# Altium schematic sheet W5500.SchDoc
size A4
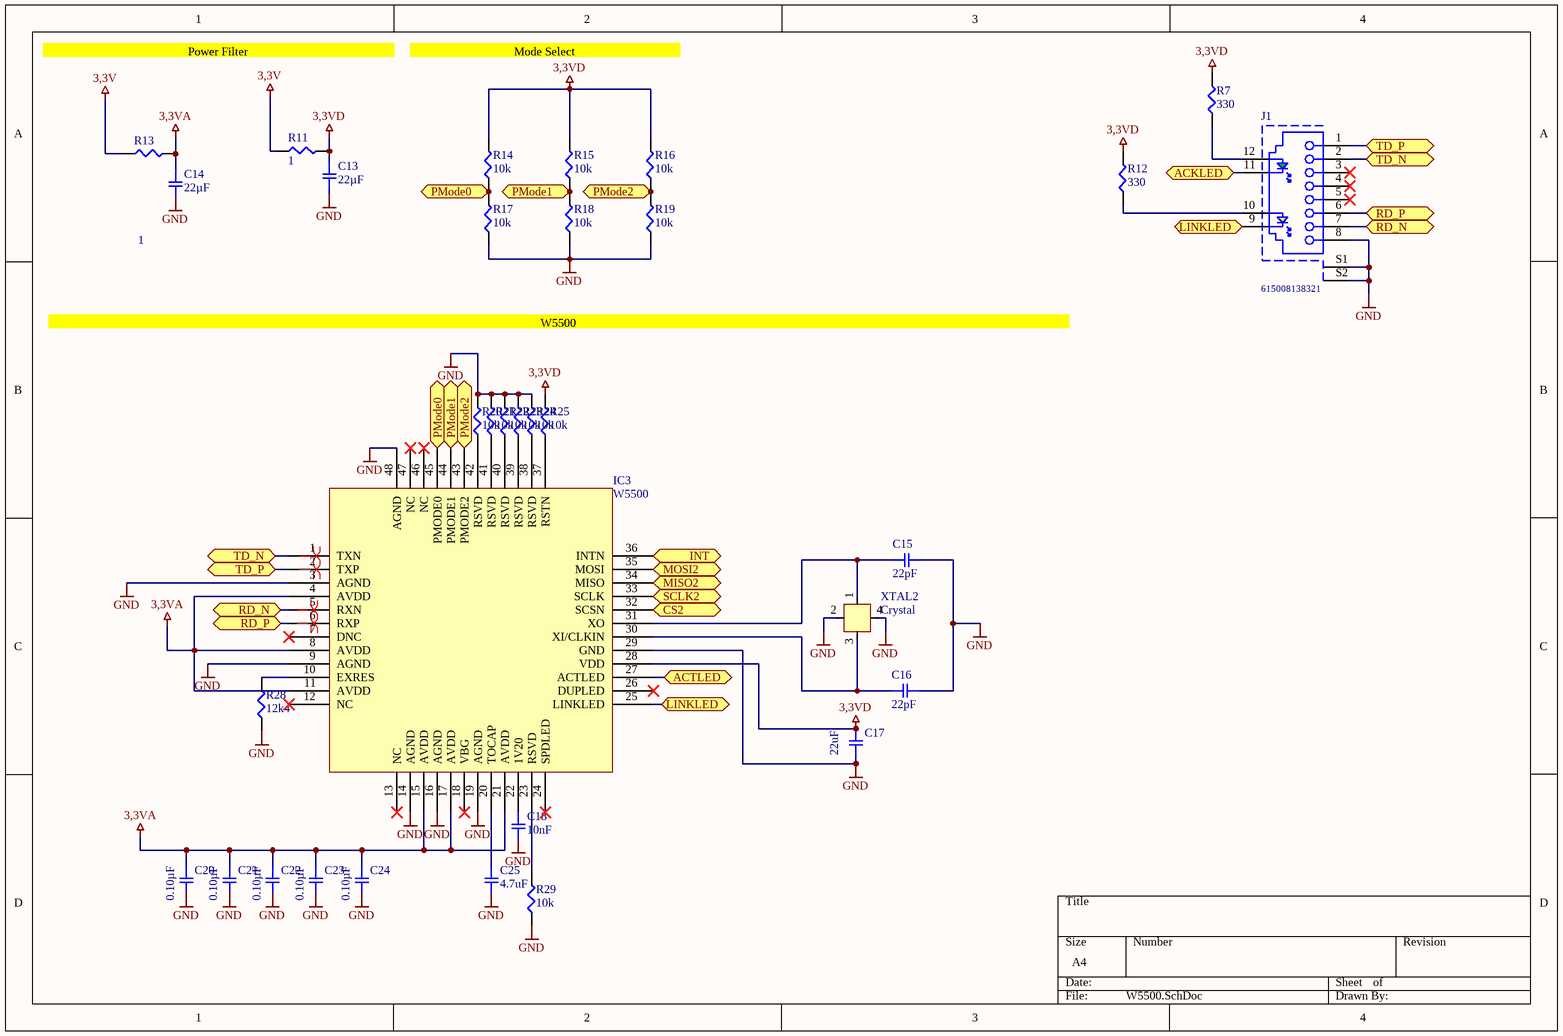
[diagram p0: W5500.SchDoc]

## Parts
C13  22µF  [SMD-0603C]
C14  22µF  [SMD-0603C]
C15  22pF  [SMD-0603C]
C16  22pF  [SMD-0603C]
C17  22uF  [SMD-0603C]
C18  10nF  [SMD-0603C]
C20  0.10µF  [SMD-0603C]
C21  0.10µF  [SMD-0603C]
C22  0.10µF  [SMD-0603C]
C23  0.10µF  [SMD-0603C]
C24  0.10µF  [SMD-0603C]
C25  4.7uF  [SMD-0603C]
IC3  W5500  [LQFP-48]
J1  615008138321  [615008138321]
R7  330  [SMD-0603-RES]
R11  1  [SMD-0805-RES]
R12  330  [SMD-0603-RES]
R13  1  [SMD-0805-RES]
R14  10k  [SMD-0603-RES]
R15  10k  [SMD-0603-RES]
R16  10k  [SMD-0603-RES]
R17  10k  [SMD-0603-RES]
R18  10k  [SMD-0603-RES]
R19  10k  [SMD-0603-RES]
R20  10k  [SMD-0603-RES]
R21  10k  [SMD-0603-RES]
R22  10k  [SMD-0603-RES]
R23  10k  [SMD-0603-RES]
R24  10k  [SMD-0603-RES]
R25  10k  [SMD-0603-RES]
R28  12k4  [SMD-0603-RES]
R29  10k  [SMD-0603-RES]
XTAL2  Crystal  [3225]

## Ports
ACKLED (bidir), ACTLED (bidir), CS2 (bidir), INT (bidir), LINKLED (bidir), MISO2 (bidir), MOSI2 (bidir), PMode0 (bidir), PMode1 (bidir), PMode2 (bidir), RD_N (bidir), RD_P (bidir), SCLK2 (bidir), TD_N (bidir), TD_P (bidir)

## Nets
3,3V: R11.1 R13.1
3,3VA: C14.1 C20.1 C21.1 C22.1 C23.1 C24.1 IC3.4(AVDD) IC3.8(AVDD) IC3.11(AVDD) IC3.15(AVDD) IC3.17(AVDD) IC3.21(AVDD) R13.2
3,3VD: C13.1 C17.1 IC3.28(VDD) R7.2 R11.2 R12.2 R14.2 R15.2 R16.2 R25.2
GND: C13.2 C14.2 C15.1 C16.1 C17.2 C18.2 C20.2 C21.2 C22.2 C23.2 C24.2 C25.2 IC3.3(AGND) IC3.9(AGND) IC3.14(AGND) IC3.16(AGND) IC3.19(AGND) IC3.29(GND) IC3.48(AGND) J1.8 J1.S1 J1.S2 R17.1 R18.1 R19.1 R20.2 R21.2 R22.2 R23.2 R24.2 R28.1 R29.1 XTAL2.2 XTAL2.4
ACKLED: J1.11 ; port ACKLED
ACTLED: IC3.27(ACTLED) ; port ACTLED
CS2: IC3.32(SCSN) ; port CS2
INT: IC3.36(INTN) ; port INT
LINKLED: IC3.25(LINKLED) J1.9 ; port LINKLED
MISO2: IC3.34(MISO) ; port MISO2
MOSI2: IC3.35(MOSI) ; port MOSI2
PMode0: IC3.45(PMODE0) R14.1 R17.2 ; port PMode0
PMode1: IC3.44(PMODE1) R15.1 R18.2 ; port PMode1
PMode2: IC3.43(PMODE2) R16.1 R19.2 ; port PMode2
RD_N: IC3.5(RXN) J1.7 ; port RD_N
RD_P: IC3.6(RXP) J1.6 ; port RD_P
SCLK2: IC3.33(SCLK) ; port SCLK2
TD_N: IC3.1(TXN) J1.2 ; port TD_N
TD_P: IC3.2(TXP) J1.1 ; port TD_P
NetC15_2: C15.2 IC3.31(XO) XTAL2.1
NetC16_2: C16.2 IC3.30(XI/CLKIN) XTAL2.3
NetC18_1: C18.1 IC3.22(1V20)
NetC25_1: C25.1 IC3.20(TOCAP)
NetIC3_10: IC3.10(EXRES) R28.2
NetIC3_23: IC3.23(RSVD) R29.2
NetIC3_37: IC3.37(RSTN) R25.1
NetIC3_38: IC3.38(RSVD) R24.1
NetIC3_39: IC3.39(RSVD) R23.1
NetIC3_40: IC3.40(RSVD) R22.1
NetIC3_41: IC3.41(RSVD) R21.1
NetIC3_42: IC3.42(RSVD) R20.1
NetJ1_10: J1.10 R12.1
NetJ1_12: J1.12 R7.1

Not connected (* = marked no-connect by the designer): IC3 7(DNC)* 12(NC)* 13(NC)* 18(VBG)* 24(SPDLED)* 26(DUPLED)* 46(NC)* 47(NC)*; J1 3* 4* 5*

## Layout directives
differential pair: (no net found under the mark)

## Notes on the sheet
- Power Filter
- Mode Select
- W5500

## Library data of the parts
C13 C14 = ZRB186R60G226ME11L: CAP CER 22UF 4V X5R 0603; Manufacturer: Murata Electronics North America; Factory Stock: 0; Unit Price (USD): 0.36; Minimum Quantity: 1; Tolerance: ±20%; Datasheets: http://psearch.en.murata.com/capacitor/product/ZRB186R60G226ME11%23.pdf; Image: //media.digikey.com/Renders/Murata%20Renders/0603%20(1608%20Metric).jpg; Digi-Key Part Number: 490-13253-1-ND; Part Number: ZRB186R60G226ME11L; Quantity Available: 3925; @ qty: 0; Packaging: Cut Tape (CT); Series: ZRB; Part Status: Active; Value: 22µF; Voltage: 4V; Temperature Coefficient: X5R; Operating Temperature: -55°C ~ 85°C; Features: Interposer Termination; Ratings: -; Applications: Acoustic Noise Reduction; Mounting Type: Surface Mount, MLCC; Package / Case: 0603 (1608 Metric); Size / Dimension: 0.063" L x 0.031" W (1.60mm x 0.80mm); Height - Seated (Max): -; Thickness (Max): 0.031" (0.80mm); Lead Spacing: -; Lead Style: -
C15 C16 = GCM188R72A223KA37D: CAP CER 0.022UF 100V X7R 0603; Manufacturer: Murata Electronics North America; Factory Stock: 0; Unit Price (USD): 0.11; Minimum Quantity: 1; Tolerance: ±10%; Datasheets: http://www.murata.com/~/media/webrenewal/support/library/catalog/products/capacitor/mlcc/c03e.ashx; Image: //media.digikey.com/Renders/Murata%20Renders/0603%28GCM188%29.jpg; Digi-Key Part Number: 490-4782-1-ND; Part Number: GCM188R72A223KA37D; Quantity Available: 102005; @ qty: 0; Packaging: Cut Tape (CT); Series: GCM; Part Status: Active; Value: 22pF; Voltage: 100V; Temperature Coefficient: X7R; Operating Temperature: -55°C ~ 125°C; Features: -; Ratings: AEC-Q200; Applications: Automotive; Mounting Type: Surface Mount, MLCC; Package / Case: 0603 (1608 Metric); Size / Dimension: 0.063" L x 0.031" W (1.60mm x 0.80mm); Height - Seated (Max): -; Thickness (Max): 0.035" (0.90mm); Lead Spacing: -; Lead Style: -
C17 = GCM188R71C104KA37J: CAP CER 0.1UF 16V X7R 0603; Manufacturer: Murata Electronics North America; Factory Stock: 0; Unit Price (USD): 0.18; Minimum Quantity: 1; Tolerance: ±10%; Voltage: 6.3V; Datasheets: http://www.murata.com/~/media/webrenewal/support/library/catalog/products/capacitor/mlcc/c03e.ashx; Image: //media.digikey.com/Renders/Murata%20Renders/0603%28GCM188%29.jpg; Digi-Key Part Number: 490-8015-1-ND; Part Number: GCM188R71C104KA37J; Quantity Available: 17844; @ qty: 0; Packaging: Cut Tape (CT); Series: GCM; Part Status: Active; Value: 22uF; Temperature Coefficient: X7R; Operating Temperature: -55°C ~ 125°C; Features: -; Ratings: AEC-Q200; Applications: Automotive; Mounting Type: Surface Mount, MLCC; Package / Case: 0603 (1608 Metric); Size / Dimension: 0.063" L x 0.031" W (1.60mm x 0.80mm); Height - Seated (Max): -; Thickness (Max): 0.035" (0.90mm); Lead Spacing: -; Lead Style: -
C18 = GCJ188R71C104KA01D: CAP CER 0.1UF 16V X7R 0603; Manufacturer: Murata Electronics North America; Factory Stock: 0; Unit Price (USD): 0.21; Minimum Quantity: 1; Tolerance: ±10%; Datasheets: http://www.murata.com/~/media/webrenewal/support/library/catalog/products/capacitor/mlcc/c03e.ashx; Image: //media.digikey.com/Renders/Murata%20Renders/0603%28LQG18%29.jpg; Digi-Key Part Number: 490-5796-1-ND; Part Number: GCJ188R71C104KA01D; Quantity Available: 22473; @ qty: 0; Packaging: Cut Tape (CT); Series: GCJ; Part Status: Active; Value: 10nF; Voltage: 16V; Temperature Coefficient: X7R; Operating Temperature: -55°C ~ 125°C; Features: Soft Termination; Ratings: AEC-Q200; Applications: Automotive, Boardflex Sensitive; Mounting Type: Surface Mount, MLCC; Package / Case: 0603 (1608 Metric); Size / Dimension: 0.063" L x 0.031" W (1.60mm x 0.80mm); Height - Seated (Max): -; Thickness (Max): 0.035" (0.90mm); Lead Spacing: -; Lead Style: -
C20-C24 = GCM188R71C104KA37J: CAP CER 0.1UF 16V X7R 0603; Manufacturer: Murata Electronics North America; Factory Stock: 0; Unit Price (USD): 0.18; Minimum Quantity: 1; Tolerance: ±10%; Datasheets: http://www.murata.com/~/media/webrenewal/support/library/catalog/products/capacitor/mlcc/c03e.ashx; Image: //media.digikey.com/Renders/Murata%20Renders/0603%28GCM188%29.jpg; Digi-Key Part Number: 490-8015-1-ND; Part Number: GCM188R71C104KA37J; Quantity Available: 17844; @ qty: 0; Packaging: Cut Tape (CT); Series: GCM; Part Status: Active; Value: 0.10µF; Voltage: 16V; Temperature Coefficient: X7R; Operating Temperature: -55°C ~ 125°C; Features: -; Ratings: AEC-Q200; Applications: Automotive; Mounting Type: Surface Mount, MLCC; Package / Case: 0603 (1608 Metric); Size / Dimension: 0.063" L x 0.031" W (1.60mm x 0.80mm); Height - Seated (Max): -; Thickness (Max): 0.035" (0.90mm); Lead Spacing: -; Lead Style: -
C25 = GCJ188R71C104KA01D: CAP CER 0.1UF 16V X7R 0603; Manufacturer: Murata Electronics North America; Factory Stock: 0; Unit Price (USD): 0.21; Minimum Quantity: 1; Tolerance: ±10%; Voltage: 6.3V; Datasheets: http://www.murata.com/~/media/webrenewal/support/library/catalog/products/capacitor/mlcc/c03e.ashx; Image: //media.digikey.com/Renders/Murata%20Renders/0603%28LQG18%29.jpg; Digi-Key Part Number: 490-5796-1-ND; Part Number: GCJ188R71C104KA01D; Quantity Available: 22473; @ qty: 0; Packaging: Cut Tape (CT); Series: GCJ; Part Status: Active; Value: 4.7uF; Temperature Coefficient: X7R; Operating Temperature: -55°C ~ 125°C; Features: Soft Termination; Ratings: AEC-Q200; Applications: Automotive, Boardflex Sensitive; Mounting Type: Surface Mount, MLCC; Package / Case: 0603 (1608 Metric); Size / Dimension: 0.063" L x 0.031" W (1.60mm x 0.80mm); Height - Seated (Max): -; Thickness (Max): 0.035" (0.90mm); Lead Spacing: -; Lead Style: -
J1 = 615008138321: Modular Jack WR-MJ, Shielded, with LED, Vertical Entry, THT, 8P8C; Port: 1x1; Compliance: Lead free / RoHS; Rated Current: 1.5 A; Working Voltage: 120 VAC; Withstanding Voltage: 1000 VAC; Contact Resistance: 20 mOhm; ComponentLink1Description: Manufacturer; ComponentLink1URL: http://www.we-online.de; ComponentLink2Description: Datasheet; ComponentLink2URL: https://katalog.we-online.com/em/datasheet/615008138321%284%29.pdf; Part Number: 615008138321; Published Date: July 2018; Publisher: Wurth Elektronik; Pin Number: 8P8C; Operating Temperature: -40 to 85 degC; Mounting Technology: THT; Packaging: Tray; Entrance: Vertical
R7 R12 = ERJ-3EKF3300V: RES SMD 330 OHM 1% 1/10W 0603; Manufacturer: Panasonic Electronic Components; Factory Stock: 0; Unit Price (USD): 0.00379; @ qty: 1500; Minimum Quantity: 1; Power (Watts): 0.1W, 1/10W; Temperature Coefficient: ±100ppm/°C; Part Number: ERJ-3EKF3300V; Datasheets: http://industrial.panasonic.com/www-cgi/jvcr13pz.cgi?E+PZ+3+AOA0002+ERJ3EKF3300V+7+WW; Image: //media.digikey.com/Photos/Panasonic%20Photos/MFG_ERJ-P6W%20Series.jpg; Digi-Key Part Number: P330HCT-ND; Quantity Available: 670984; Packaging: Cut Tape (CT); Series: ERJ; Part Status: Active; Value: 330; Tolerance: ±1%; Composition: Thick Film; Features: Automotive AEC-Q200; Operating Temperature: -55°C ~ 155°C; Package / Case: 0603 (1608 Metric); Supplier Device Package: 0603; Size / Dimension: 0.063" L x 0.031" W (1.60mm x 0.80mm); Height - Seated (Max): 0.022" (0.55mm); Number of Terminations: 2; Failure Rate: -
R11 R13 = ERJ-6BQF1R0V: RES SMD 1 OHM 1% 1/3W 0805; Manufacturer: Panasonic Electronic Components; Factory Stock: 0; Unit Price (USD): 0.05834; @ qty: 1500; Power (Watts): 0.333W, 1/3W; Temperature Coefficient: ±200ppm/°C; Part Number: ERJ-6BQF1R0V; Datasheets: https://industrial.panasonic.com/cdbs/www-data/pdf/RDA0000/AOA0000C239.pdf; Image: //media.digikey.com/Renders/Panasonic%20Renders/ERJ-0805%20Pkg.jpg; Digi-Key Part Number: P17499CT-ND; Quantity Available: 808; Minimum Quantity: 1; Packaging: Cut Tape (CT); Series: ERJ; Part Status: Active; Value: 1; Tolerance: ±1%; Composition: Thick Film; Features: Automotive AEC-Q200, Current Sense; Operating Temperature: -55°C ~ 125°C; Package / Case: 0805 (2012 Metric); Supplier Device Package: 0805; Size / Dimension: 0.079" L x 0.049" W (2.00mm x 1.25mm); Height - Seated (Max): 0.028" (0.70mm); Number of Terminations: 2; Failure Rate: -
R14-R25 R29 = ERJ-3EKF1002V: RES SMD 10K OHM 1% 1/10W 0603; Manufacturer: Panasonic Electronic Components; Factory Stock: 0; Unit Price (USD): 0.00379; @ qty: 1500; Minimum Quantity: 1; Power (Watts): 0.1W, 1/10W; Temperature Coefficient: ±100ppm/°C; Part Number: ERJ-3EKF1002V; Datasheets: http://industrial.panasonic.com/www-cgi/jvcr13pz.cgi?E+PZ+3+AOA0002+ERJ3EKF1002V+7+WW; Image: //media.digikey.com/Photos/Panasonic%20Photos/MFG_ERJ-P6W%20Series.jpg; Digi-Key Part Number: P10.0KHCT-ND; Quantity Available: 6703141; Packaging: Cut Tape (CT); Series: ERJ; Part Status: Active; Value: 10k; Tolerance: ±1%; Composition: Thick Film; Features: Automotive AEC-Q200; Operating Temperature: -55°C ~ 155°C; Package / Case: 0603 (1608 Metric); Supplier Device Package: 0603; Size / Dimension: 0.063" L x 0.031" W (1.60mm x 0.80mm); Height - Seated (Max): 0.022" (0.55mm); Number of Terminations: 2; Failure Rate: -
R28 = ERJ-3BQF1R1V: RES SMD 12,4 KOHM 1% 1/4W 0603; Manufacturer: Panasonic Electronic Components; Factory Stock: 0; Unit Price (USD): 0.05386; @ qty: 1500; Minimum Quantity: 1; Power (Watts): 0.25W, 1/4W; Temperature Coefficient: ±200ppm/°C; Part Number: ERJ-3BQF1R1V; Datasheets: https://industrial.panasonic.com/cdbs/www-data/pdf/RDA0000/AOA0000C239.pdf; Image: //media.digikey.com/Photos/Panasonic%20Photos/MFG_ERJ-P6W%20Series.jpg; Digi-Key Part Number: P17372CT-ND; Quantity Available: 3896; Packaging: Cut Tape (CT); Series: ERJ; Part Status: Active; Value: 12k4; Tolerance: ±1%; Composition: Thick Film; Features: Automotive AEC-Q200, Current Sense; Operating Temperature: -55°C ~ 125°C; Package / Case: 0603 (1608 Metric); Supplier Device Package: 0603; Size / Dimension: 0.063" L x 0.031" W (1.60mm x 0.80mm); Height - Seated (Max): 0.022" (0.55mm); Number of Terminations: 2; Failure Rate: -
XTAL2 = 3225